# Altium project PCB_Project_6.PrjPcb
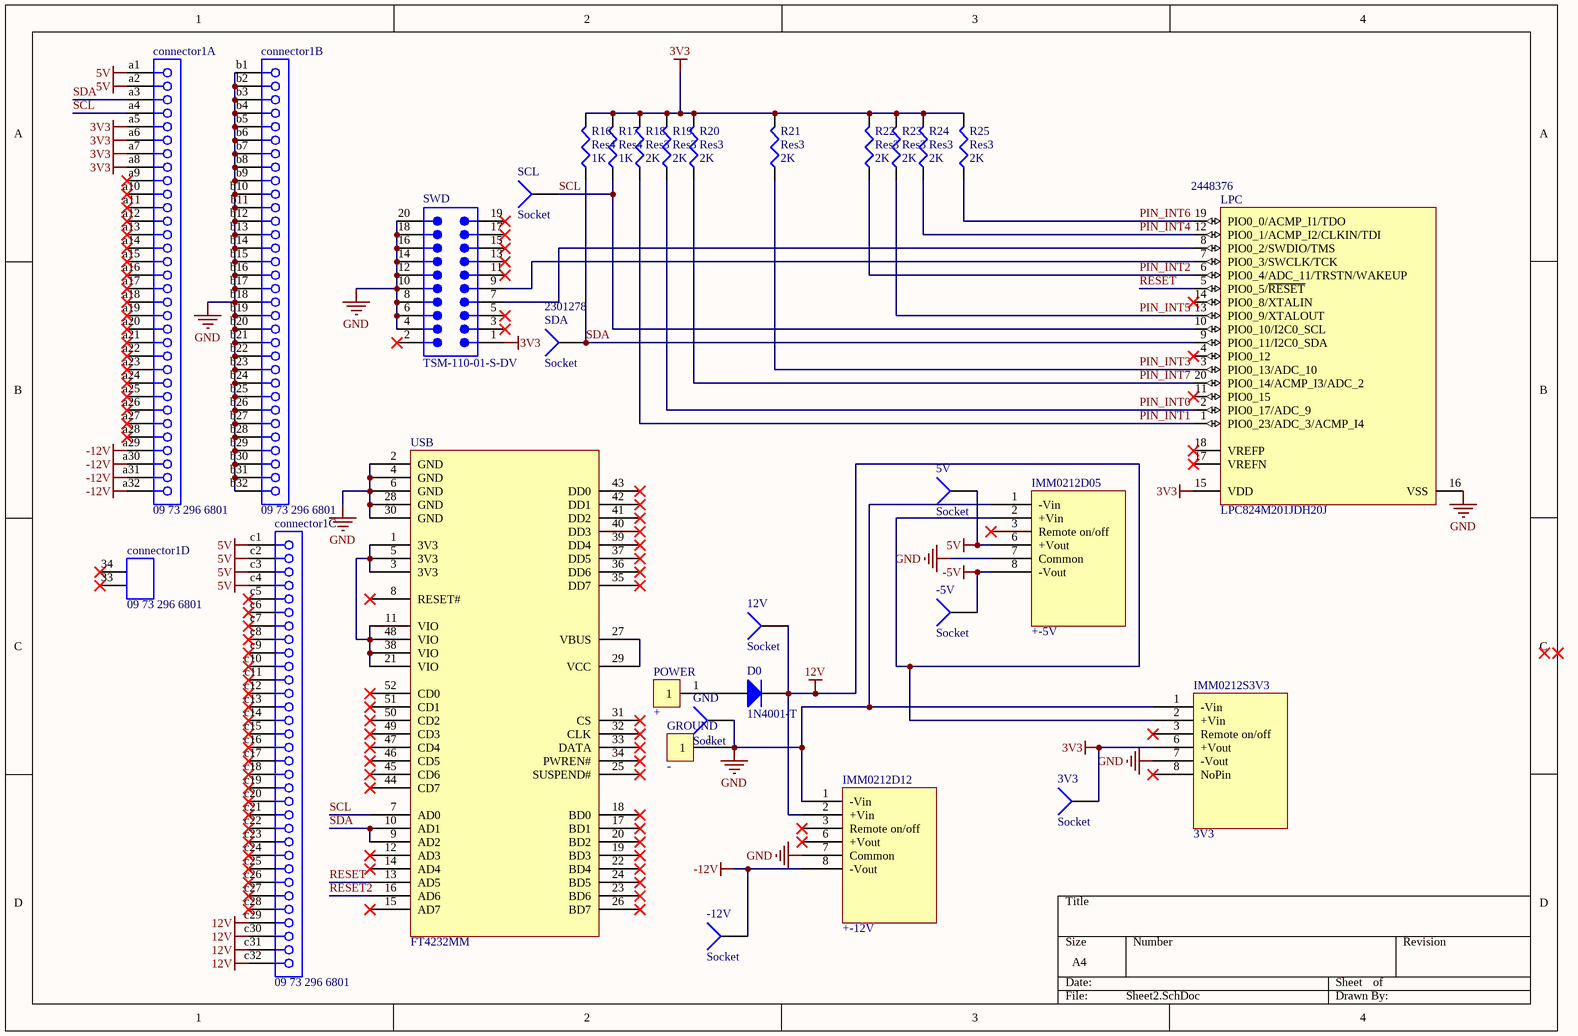
[diagram p0: Sheet2.SchDoc]
2 sheets, 63 parts. Net scope: global (net labels, ports and power ports of the same name join across sheets).
Board file: Signalgeneratortest.PcbDoc
Sheets:
  Sheet2.SchDoc
  Sheet4.SchDoc

## Sheet Sheet2.SchDoc
size A4

### Parts
3V3  Socket  [CON1]
5V  Socket  [CON1]
12V  Socket  [CON1]
-5V  Socket  [CON1]
-12V  Socket  [CON1]
connector1  09 73 296 6801  [0973296X801]  (parts A,B,C,D of 4)
D0  1N4001-T  [DIOD-DO-41-P-2_V]
GND  Socket  [CON1]
GROUND  -  [RA]
IMM0212D05  +-5V  [SIP8]
IMM0212D12  +-12V  [SIP8]
IMM0212S3V3  3V3  [SIP8]
LPC  LPC824M201JDH20J  Supplier Part Number 1: 2448376  [NXP-SOT360-1_N]
POWER  +  [RA]
R16  Res4  value 1K  [J1-0603]
R17  Res4  value 1K  [J1-0603]
R18  Res3  value 2K  [J1-0603]
R19  Res3  value 2K  [J1-0603]
R20  Res3  value 2K  [J1-0603]
R21  Res3  value 2K  [J1-0603]
R22  Res3  value 2K  [J1-0603]
R23  Res3  value 2K  [J1-0603]
R24  Res3  value 2K  [J1-0603]
R25  Res3  value 2K  [J1-0603]
SCL  Socket  [CON1]
SDA  Socket  Supplier Part Number 1: 2301278  [CON1]
SWD  TSM-110-01-S-DV  [SMTC-TSM-110-01-X-DV]
USB  FT4232MM  [FT4232MM]

### Nets
3V3: 3V3.1 connector1.a5 connector1.a6 connector1.a7 connector1.a8 IMM0212S3V3.6(+Vout) LPC.15(VDD) R16.2 R17.2 R18.2 R19.2 R20.2 R21.2 R22.2 R23.2 R24.2 R25.2 SWD.1
5V: 5V.1 connector1.a1 connector1.a2 connector1.c1 connector1.c2 connector1.c3 connector1.c4 IMM0212D05.6(+Vout)
12V: 12V.1 connector1.c29 connector1.c30 connector1.c31 connector1.c32 D0.2(K) IMM0212D05.2(+Vin) IMM0212D12.2(+Vin) IMM0212S3V3.2(+Vin)
-5V: -5V.1 IMM0212D05.8(-Vout)
-12V: -12V.1 connector1.a29 connector1.a30 connector1.a31 connector1.a32 IMM0212D12.8(-Vout)
GND: connector1.b1 connector1.b2 connector1.b3 connector1.b4 connector1.b5 connector1.b6 connector1.b7 connector1.b8 connector1.b9 connector1.b10 connector1.b11 connector1.b12 connector1.b13 connector1.b14 connector1.b15 connector1.b16 connector1.b17 connector1.b18 connector1.b19 connector1.b20 connector1.b21 connector1.b22 connector1.b23 connector1.b24 connector1.b25 connector1.b26 connector1.b27 connector1.b28 connector1.b29 connector1.b30 connector1.b31 connector1.b32 GND.1 GROUND.1 IMM0212D05.1(-Vin) IMM0212D05.7(Common) IMM0212D12.1(-Vin) IMM0212D12.7(Common) IMM0212S3V3.1(-Vin) IMM0212S3V3.7(-Vout) LPC.16(VSS) SWD.4 SWD.6 SWD.8 SWD.10 SWD.12 SWD.14 SWD.16 SWD.18 SWD.20 USB.2(GND) USB.4(GND) USB.6(GND) USB.28(GND) USB.30(GND)
PIN_INT0: LPC.2(PIO0_17/ADC_9) R19.1
PIN_INT1: LPC.1(PIO0_23/ADC_3/ACMP_I4) R18.1
PIN_INT2: LPC.6(PIO0_4/ADC_11/TRSTN/WAKEUP) R22.1
PIN_INT3: LPC.3(PIO0_13/ADC_10) R21.1
PIN_INT4: LPC.12(PIO0_1/ACMP_I2/CLKIN/TDI) R24.1
PIN_INT5: LPC.13(PIO0_9/XTALOUT) R23.1
PIN_INT6: LPC.19(PIO0_0/ACMP_I1/TDO) R25.1
PIN_INT7: LPC.20(PIO0_14/ACMP_I3/ADC_2) R20.1
RESET: LPC.5(PIO0_5/~{RESET}) USB.13(AD5)
RESET2: USB.16(AD6)
SCL: connector1.a4 LPC.10(PIO0_10/I2C0_SCL) R17.1 SCL.1 USB.7(AD0)
SDA: connector1.a3 LPC.9(PIO0_11/I2C0_SDA) R16.1 SDA.1 USB.9(AD2) USB.10(AD1)
NetD0_1: D0.1(A) POWER.1
NetLPC_7: LPC.7(PIO0_3/SWCLK/TCK) SWD.9
NetLPC_8: LPC.8(PIO0_2/SWDIO/TMS) SWD.7
NetUSB_1: USB.1(3V3) USB.3(3V3) USB.5(3V3) USB.11(VIO) USB.21(VIO) USB.38(VIO) USB.48(VIO)
NetUSB_27: USB.27(VBUS) USB.29(VCC)

Not connected (* = marked no-connect by the designer): connector1 33(MH1)* 34(MH2)* a9* a10* a11* a12* a13* a14* a15* a16* a17* a18* a19* a20* a21* a22* a23* a24* a25* a26* a27* a28* c5* c6* c7* c8* c9* c10* c11* c12* c13* c14* c15* c16* c17* c18* c19* c20* c21* c22* c23* c24* c25* c26* c27* c28*; IMM0212D05 3(Remote_on/off)*; IMM0212D12 3(Remote_on/off)* 6(+Vout)*; IMM0212S3V3 3(Remote_on/off)* 8(NoPin)*; LPC 4(PIO0_12)* 11(PIO0_15)* 14(PIO0_8/XTALIN)* 17(VREFN)* 18(VREFP)*; SWD 2* 3* 5* 11* 13* 15* 17* 19*; USB 8(RESET#)* 12(AD3)* 14(AD4)* 15(AD7)* 17(BD1)* 18(BD0)* 19(BD3)* 20(BD2)* 22(BD4)* 23(BD6)* 24(BD5)* 25(SUSPEND#)* 26(BD7)* 31(CS)* 32(CLK)* 33(DATA)* 34(PWREN#)* 35(DD7)* 36(DD6)* 37(DD5)* 39(DD4)* 40(DD3)* 41(DD2)* 42(DD1)* 43(DD0)* 44(CD7)* 45(CD6)* 46(CD5)* 47(CD4)* 49(CD3)* 50(CD2)* 51(CD1)* 52(CD0)*

### Library data of the parts
connector1 = 09 73 296 6801: Eurocard DIN 41612, Type R, 96 Position, Rows a+b+c, Performance level 2, Female, Lead 3.0 mm, Pitch 2.54 mm; DrillSize: Corresponds to nominal value.; Published: 6-Oct-2005; DatasheetDocument: 24-Nov-2004; PackageDocument: 17-Aug-1998; PackageReference: 0973296X801; Publisher: Altium Limited; ComponentLink1Description: Manufacturer Link; ComponentLink1URL: http://www.harting.com/; ComponentLink2Description: Packaging Specification; ComponentLink2URL: http://www.harkis.harting.com/_gds/pdf/TB_0973296x801_BL01_R31100.pdf
D0 = CMP-0639-00006-2: 1.0 A Rectifier, 15 pF, 50 V, -65 to 150 degC, 2-Pin DO-41 Plastic, RoHS, Tape and Reel; Manufacturer: Diodes Inc; VF (V): 1; CT (pF): 15; Max. IR (uA): 5; VRRM (V): 50; Max. IFSM (A): 30; RoHS: TRUE; Mounting Technology: Through Hole; PartNumber: 1N4001-T; ComponentLink2Description: Datasheet; DatasheetVersion: Rev. 8-2; Operating Temperature Range (degC): -65 to 150; Packing: Tape and Reel; PackageReference: DO-41-P-2; ComponentLink1URL: http://diodes.com/; PackageDescription: 2-Pin Axial Lead, Body 4.635 x 2.36 mm, Lead Spread 25.4 mm; ComponentLink2URL: http://diodes.com/datasheets/ds28002.pdf; Max. Average Rectified Current IO (A): 1; ComponentLink1Description: Manufacturer URL; Supplier 1: Farnell; Supplier Part Number 1: 1843694
GROUND POWER = Power: Supplier 1: Farnell; Supplier Part Number 1: 1085521
IMM0212D05 IMM0212D12 = IMM0212D05: Supplier 1: Farnell
  IMM0212D05: Supplier Part Number 1: 2526539
  IMM0212D12: Supplier Part Number 1: 2526540
IMM0212S3V3 = Component_1: Supplier 1: Farnell; Supplier Part Number 1: 2526545
LPC = CMP-0173-00095-1: 32-bit ARM Cortex-M0+ Microcontroller, 16 I/O, 32 KB Flash, 8 KB SRAM, -40 to 105 degC, 20-Pin TSSOP, Reel, RoHS; Manufacturer: NXP Semiconductors; Clock Speed: 30 MHz max.; Flash: 32 KB; RAM: 8 KB; Mounting Technology: Surface Mount; Packing: Reel; Code_JEDEC: MO-153; ComponentLink2Description: Datasheet; Core: Cortex-M0+; ComponentLink1URL: www.nxp.com; ComponentLink3Description: Package Specification; ComponentLink1Description: Manufacturer URL; ComponentLink2URL: http://www.nxp.com/documents/data_sheet/LPC82X.pdf; ComponentLink3URL: http://www.nxp.com/documents/outline_drawing/sot360-1_po.pdf; PartNumber: LPC824M201JDH20; DatasheetVersion: Rev. 1; PackageDescription: 20-Pin Plastic Thin Shrink Small Outline Package, Body 6.5 x 4.4 mm, Pitch 0.65 mm; PackageVersion: 03-02-19, 02/2003; Supplier 1: Farnell
R16-R25 = Res3: Resistor; Published: 8-Jun-2000; LatestRevisionDate: 29-May-2009; LatestRevisionNote: IPC-7351 Footprint Added.; PackageReference: J1-0603; Publisher: Altium Limited; PackageDescription: Chip Resistor; Supplier 1: Farnell
  R16 R17: Supplier Part Number 1: 2059601RL
  R18-R25: Supplier Part Number 1: 2059611
SWD = CMP-1024-00283-1: 0.025" SQ Post Header, Surface Mount, Vertical, -55 to 125 degC, 2.54 mm Pitch, 20-Pin, Male, RoHS; Manufacturer: Samtec; Pitch: 2.54 mm; DatasheetVersion: F-214; ComponentLink2Description: Datasheet; ComponentLink3URL: http://www.samtec.com/documents/webfiles/cpdf/TSM-1XX-XX-XXX-XX-X-XXX-X-MKT.pdf; ComponentLink1Description: Manufacturer URL; PackageDescription: Double Row Gullwing ASM; ComponentLink1URL: http://www.samtec.com; PackageVersion: DJ, 4/1991; ComponentLink2URL: http://www.samtec.com/documents/webfiles/pdf/TSM.PDF; Mounting Technology: Surface Mount; Temperature Range: -55 to 125 degC; PartNumber: TSM-110-01-S-DV; ComponentLink3Description: Package Specification; Orientation: Vertical; PackageReference: TSM-110-01-X-DV; RoHS: True; Supplier 1: Farnell; Supplier Part Number 1: 2055874
USB = FT4232MM: FDTI mini module
3V3 5V 12V -5V -12V GND SCL SDA = Socket: LatestRevisionDate: 17-Jul-2002; LatestRevisionNote: Re-released for DXP Platform.; Publisher: Altium Limited; Supplier 1: Farnell
  3V3 5V 12V -5V -12V GND SCL: Supplier Part Number 1: 2301278

## Sheet Sheet4.SchDoc
size A4
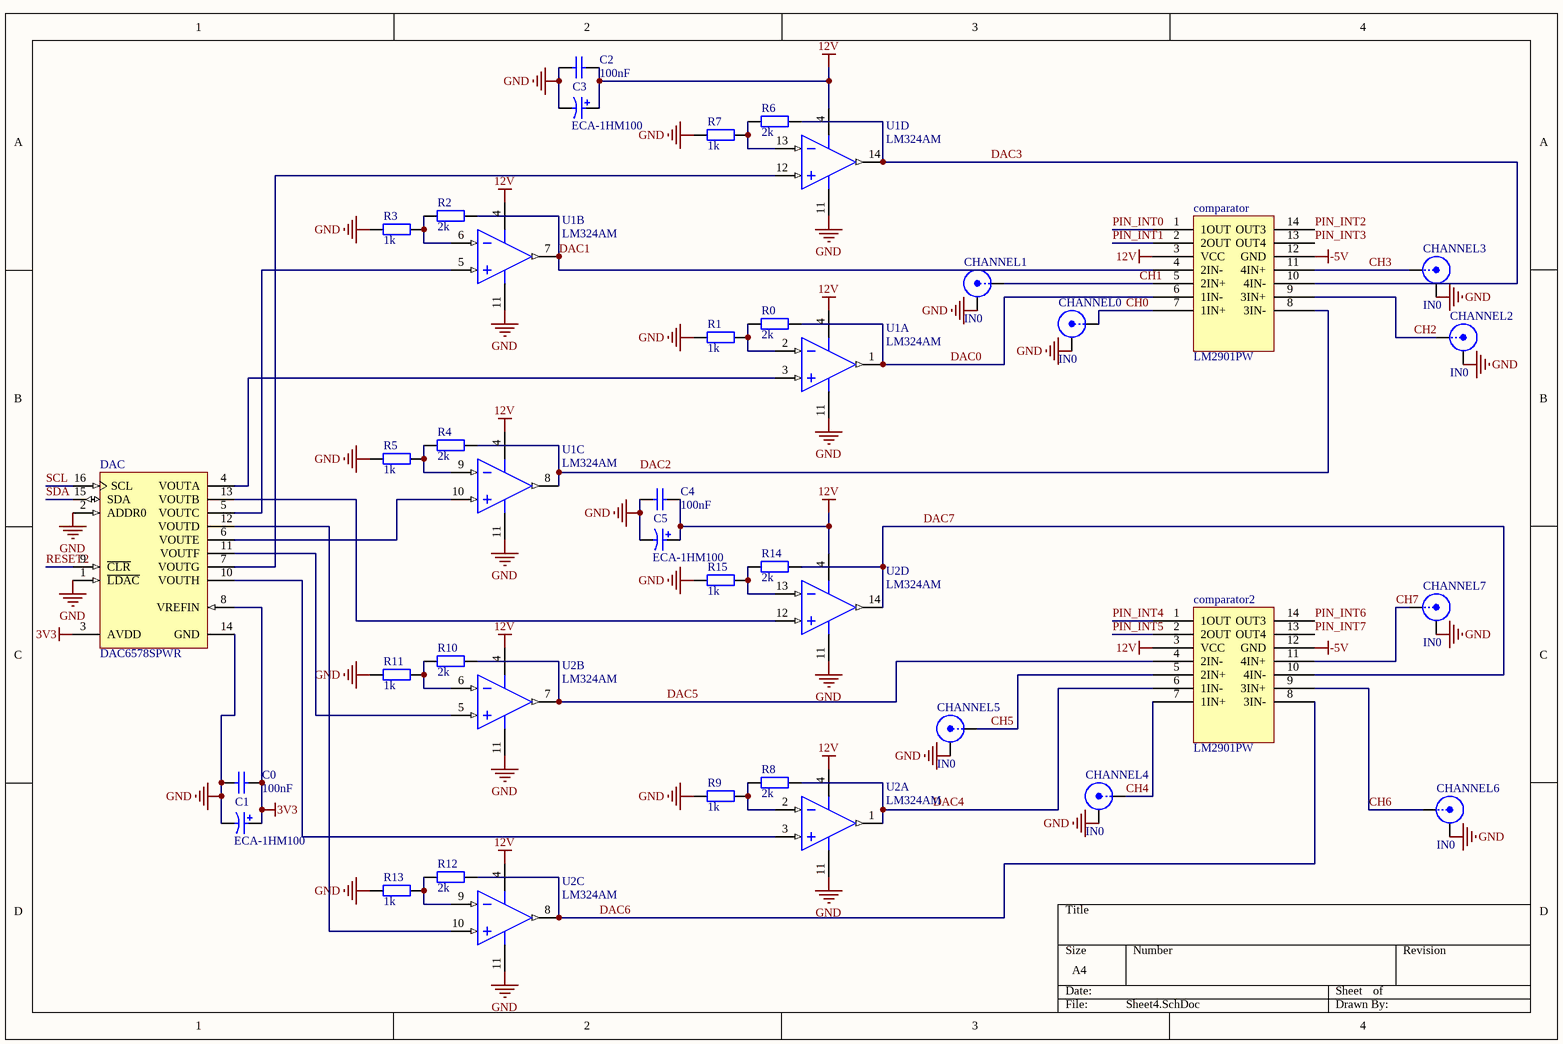
[diagram p1: Sheet4.SchDoc]

### Parts
C0  100nF  [C0805]
C1  ECA-1HM100  [CAPPR55-200-1100X500X1200]
C2  100nF  [C0805]
C3  ECA-1HM100  [CAPPR55-200-1100X500X1200]
C4  100nF  [C0805]
C5  ECA-1HM100  [CAPPR55-200-1100X500X1200]
CHANNEL0  IN0  [SMB]
CHANNEL1  IN0  [SMB]
CHANNEL2  IN0  [SMB]
CHANNEL3  IN0  [SMB]
CHANNEL4  IN0  [SMB]
CHANNEL5  IN0  [SMB]
CHANNEL6  IN0  [SMB]
CHANNEL7  IN0  [SMB]
comparator  LM2901PW  [TSSOP-14]
comparator2  LM2901PW  [TSSOP-14]
DAC  DAC6578SPWR  [TI-PW16_N]
R0  value 2k  [6-0805_N]  (hidden comment: 2k-0W25-0805)
R1  value 1k  [6-0805_N]  (hidden comment: 1k-0W25-0805)
R2  value 2k  [6-0805_N]  (hidden comment: 2k-0W25-0805)
R3  value 1k  [6-0805_N]  (hidden comment: 1k-0W25-0805)
R4  value 2k  [6-0805_N]  (hidden comment: 2k-0W25-0805)
R5  value 1k  [6-0805_N]  (hidden comment: 1k-0W25-0805)
R6  value 2k  [6-0805_N]  (hidden comment: 2k-0W25-0805)
R7  value 1k  [6-0805_N]  (hidden comment: 1k-0W25-0805)
R8  value 2k  [6-0805_N]  (hidden comment: 2k-0W25-0805)
R9  value 1k  [6-0805_N]  (hidden comment: 1k-0W25-0805)
R10  value 2k  [6-0805_N]  (hidden comment: 2k-0W25-0805)
R11  value 1k  [6-0805_N]  (hidden comment: 1k-0W25-0805)
R12  value 2k  [6-0805_N]  (hidden comment: 2k-0W25-0805)
R13  value 1k  [6-0805_N]  (hidden comment: 1k-0W25-0805)
R14  value 2k  [6-0805_N]  (hidden comment: 2k-0W25-0805)
R15  value 1k  [6-0805_N]  (hidden comment: 1k-0W25-0805)
U1  LM324AM  [D0014A_N]  (parts A,B,C,D of 4)
U2  LM324AM  [D0014A_N]  (parts A,B,C,D of 4)

### Nets
3V3: C0.2 C1.1 DAC.3(AVDD) DAC.8(VREFIN)
12V: C2.2 C3.1 C4.2 C5.1 comparator.3(VCC) comparator2.3(VCC) U1.4(V+) U2.4(V+)
-5V: comparator.12(GND) comparator2.12(GND)
GND: C0.1 C1.2 C2.1 C3.2 C4.1 C5.2 CHANNEL0.2(Y) CHANNEL1.2(Y) CHANNEL2.2(Y) CHANNEL3.2(Y) CHANNEL4.2(Y) CHANNEL5.2(Y) CHANNEL6.2(Y) CHANNEL7.2(Y) DAC.1(~{LDAC}) DAC.2(ADDR0) DAC.14(GND) R1.1 R3.1 R5.1 R7.1 R9.1 R11.1 R13.1 R15.1 U1.11(GND) U2.11(GND)
CH0: CHANNEL0.1(X) comparator.7(1IN+)
CH1: CHANNEL1.1(X) comparator.5(2IN+)
CH2: CHANNEL2.1(X) comparator.9(3IN+)
CH3: CHANNEL3.1(X) comparator.11(4IN+)
CH4: CHANNEL4.1(X) comparator2.7(1IN+)
CH5: CHANNEL5.1(X) comparator2.5(2IN+)
CH6: CHANNEL6.1(X) comparator2.9(3IN+)
CH7: CHANNEL7.1(X) comparator2.11(4IN+)
DAC0: comparator.6(1IN-) R0.2 U1.1(OUT1)
DAC1: comparator.4(2IN-) R2.2 U1.7(OUT2)
DAC2: comparator.8(3IN-) R4.2 U1.8(OUT3)
DAC3: comparator.10(4IN-) R6.2 U1.14(OUT4)
DAC4: comparator2.6(1IN-) R8.2 U2.1(OUT1)
DAC5: comparator2.4(2IN-) R10.2 U2.7(OUT2)
DAC6: comparator2.8(3IN-) R12.2 U2.8(OUT3)
DAC7: comparator2.10(4IN-) R14.2 U2.14(OUT4)
PIN_INT0: comparator.1(1OUT)
PIN_INT1: comparator.2(2OUT)
PIN_INT2: comparator.14(OUT3)
PIN_INT3: comparator.13(OUT4)
PIN_INT4: comparator2.1(1OUT)
PIN_INT5: comparator2.2(2OUT)
PIN_INT6: comparator2.14(OUT3)
PIN_INT7: comparator2.13(OUT4)
RESET2: DAC.9(~{CLR})
SCL: DAC.16(SCL)
SDA: DAC.15(SDA)
NetDAC_4: DAC.4(VOUTA) U1.3(IN1+)
NetDAC_5: DAC.5(VOUTC) U1.5(IN2+)
NetDAC_6: DAC.6(VOUTE) U1.10(IN3+)
NetDAC_7: DAC.7(VOUTG) U1.12(IN4+)
NetDAC_10: DAC.10(VOUTH) U2.3(IN1+)
NetDAC_11: DAC.11(VOUTF) U2.5(IN2+)
NetDAC_12: DAC.12(VOUTD) U2.10(IN3+)
NetDAC_13: DAC.13(VOUTB) U2.12(IN4+)
NetR0_1: R0.1 R1.2 U1.2(IN1-)
NetR2_1: R2.1 R3.2 U1.6(IN2-)
NetR4_1: R4.1 R5.2 U1.9(IN3-)
NetR6_1: R6.1 R7.2 U1.13(IN4-)
NetR8_1: R8.1 R9.2 U2.2(IN1-)
NetR10_1: R10.1 R11.2 U2.6(IN2-)
NetR12_1: R12.1 R13.2 U2.9(IN3-)
NetR14_1: R14.1 R15.2 U2.13(IN4-)

### Library data of the parts
C0 C2 C4 = Ceramic 100nF/50V: Capacitor Cer 50V 0805 Vishay X7R; PackageReference: 0805; Supplier 1: Farnell; Supplier Part Number 1: 1612208; Value: 100nF
C1 C3 C5 = CMP-1665-00038-1: Aluminum Electrolytic Capacitor, 10 uF, +/- 20%, 50 V, -40 to 85 degC, 2-Pin THD, RoHS, Bulk; Max Power Dissipation: 625 mW; Min Supply Voltage: 4.5 V; Max Ouput Current: 200 mA; Nominal Supply Current: 10 mA; Case\Package: SOIC; Max Supply Voltage: 16 V; Max Operating Temperature: 70 degC; DatasheetVersion: Mar-16; ComponentLink1URL: http://www.panasonic.com/; Packaging: Tape and Reel; PackageDescription: 2-Pin Radial Lead, Dia 5 mm, Body Length 11 mm; ComponentLink2Description: Datasheet; Mount: Surface Mount; Width: 4 mm; RoHSCompliant: true; Length: 5 mm; Pins: 8; PackageReference: CAPPR55-200-1100X500X1200; ComponentLink1Description: Manufacturer URL; Package Quantity: 2500; ComponentLink2URL: http://industrial.panasonic.com/cdbs/www-data/pdf/RDF0000/DMF0000COL68.pdf; Height: 1.5 mm; Radiation Hardening: No; Min Operating Temperature: 0 degC; Supplier 1: Farnell; Supplier Part Number 1: 9693769
CHANNEL0-CHANNEL7 = SMB: SMB Straight Connector; LatestRevisionDate: 17-Jul-2002; LatestRevisionNote: Re-released for DXP Platform.; Publisher: Altium Limited; Supplier 1: Farnell; Supplier Part Number 1: 1206013
DAC = CMP-0004-01130-1: 10-Bit, Octal Channel, Ultra-Low Glitch, Voltage Output, 2-Wire Interface DAC, -40 to 125 degC, 16-pin SOP (PW16), Green (RoHS & no Sb/Br); Manufacturer: Texas Instruments; DAC Channels: 8; INL(Max)(+/-LSB): 0.5; Power Consumption(Typ)(mW): 3.67; Resolution(Bits): 10; SubFamily: Precision DAC (=<10MSPS); Settling Time(us): 7; Interface: Serial I2C; DatasheetVersion: SBAS496A; ComponentLink3Description: Package Specification; Mounting Technology: Surface Mount; ComponentLink1URL: http://www.ti.com/; ComponentLink2Description: Datasheet; Code_JEDEC: MO-153; ComponentLink2URL: http://www.ti.com/general/docs/lit/getliterature.tsp?genericPartNumber=DAC6578&fileType=pdf; ComponentLink3URL: http://www.ti.com/lit/ml/mpds361/mpds361.pdf; DNL(Max)(+/-LSB): 0.5; PackageReference: PW16; PackageVersion: 4040064-4/G, 02/2011; PackageDescription: 16-Pin Plastic Small Outline, Body 5 x 4.4 mm, Pitch 0.65 mm; Eco-Plan: Green (RoHS & no Sb/Br); PartNumber: DAC6578SPWR; ComponentLink1Description: Manufacturer URL; Supplier 1: Farnell; Supplier Part Number 1: 1854519
R0-R15 = 1k-0W25-0805: Resistor; Published: 8-Jun-2000; LatestRevisionDate: 17-Jul-2002; LatestRevisionNote: Re-released for DXP Platform.; PackageReference: AXIAL-0.4; Publisher: Altium Limited; Supplier 1: Farnell
  R0 R2 R4 R6 R8 R10 R12 R14: Supplier Part Number 1: 2057613
  R1 R3 R5 R7 R9 R11 R13 R15: Supplier Part Number 1: 1750754RL
U1 U2 = CMP-0055-00794-3: Low Power Quad Operational Amplifier, 14-pin Narrow SOIC; Manufacturer: Texas Instruments; PowerWise: N; CompType: Amplifiers; PackageTopMarking: NSUZXYTTE#*LM324AM; ComponentLink1URL: http://www.ti.com/general/docs/lit/getliterature.tsp?genericPartNumber=LM324-N&fileType=pdf; PinCount: 14; Package Reference: D0014A; PackageDescription: Molded Package S.O., .150in Wide, 14 Lead; Code_IPC: SOIC127P600-14; ComponentLink1Description: Datasheet URL; RoHS: N; Code_JEDEC: MS-012AB; PartId: 1; Supplier 1: Farnell; Supplier Part Number 1: 2450779
comparator comparator2 = LM2901PW: Supplier 1: Farnell; Supplier Part Number 1: 2295995

## Nets that join several sheets
3V3: Sheet2 (18 pins), Sheet4 (C0.2 C1.1 DAC.3 DAC.8)
12V: Sheet2 (9 pins), Sheet4 (8 pins)
-5V: Sheet2 (-5V.1 IMM0212D05.8), Sheet4 (comparator.12 comparator2.12)
GND: Sheet2 (55 pins), Sheet4 (27 pins)
PIN_INT0: Sheet2 (LPC.2 R19.1), Sheet4 (comparator.1)
PIN_INT1: Sheet2 (LPC.1 R18.1), Sheet4 (comparator.2)
PIN_INT2: Sheet2 (LPC.6 R22.1), Sheet4 (comparator.14)
PIN_INT3: Sheet2 (LPC.3 R21.1), Sheet4 (comparator.13)
PIN_INT4: Sheet2 (LPC.12 R24.1), Sheet4 (comparator2.1)
PIN_INT5: Sheet2 (LPC.13 R23.1), Sheet4 (comparator2.2)
PIN_INT6: Sheet2 (LPC.19 R25.1), Sheet4 (comparator2.14)
PIN_INT7: Sheet2 (LPC.20 R20.1), Sheet4 (comparator2.13)
RESET2: Sheet2 (USB.16), Sheet4 (DAC.9)
SCL: Sheet2 (5 pins), Sheet4 (DAC.16)
SDA: Sheet2 (6 pins), Sheet4 (DAC.15)